# Altium project Lora-ver1.0.PrjPCB
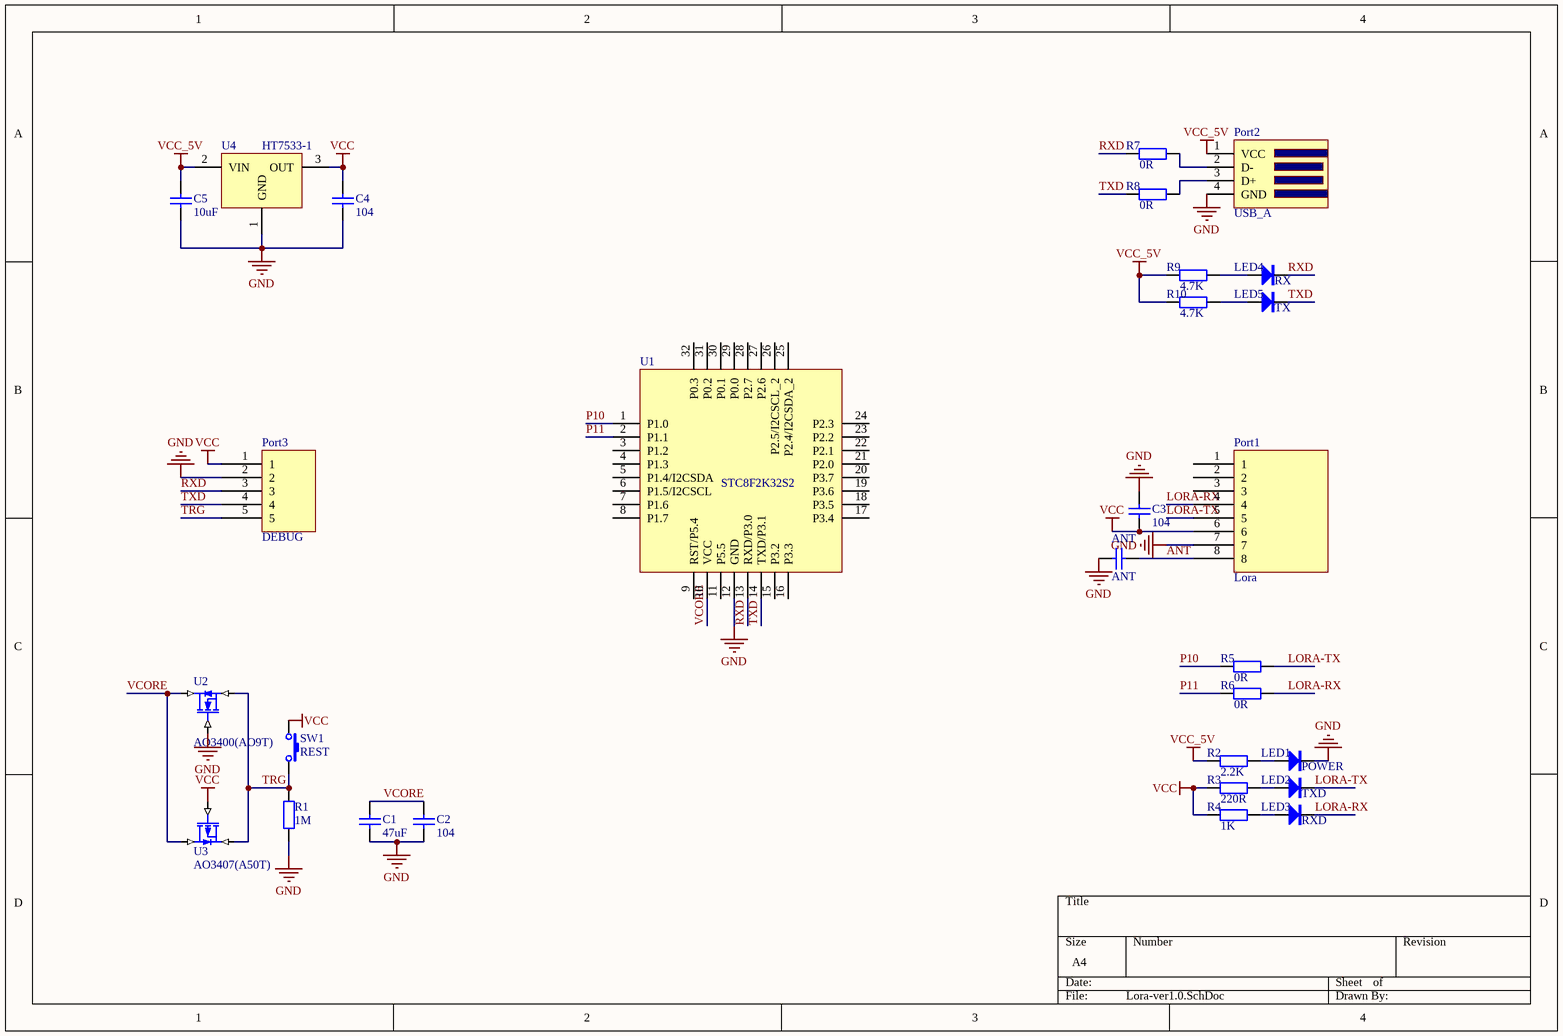
[diagram p0: Lora-ver1.0.SchDoc]
1 sheet, 29 parts. Net scope: global (net labels, ports and power ports of the same name join across sheets).
Board file: Lora_ver1.0.PcbDoc

## Sheet Lora-ver1.0.SchDoc
size A4

### Parts
ANT  ANT  [SWA-KE天线母座]
C1  47uF  [0603]
C2  104  [0603]
C3  104  [0603]
C4  104  [0603]
C5  10uF  [0603]
LED1  POWER  [2.54LED]
LED2  TXD  [2.54LED]
LED3  RXD  [2.54LED]
LED4  RX  [LED-0603]
LED5  TX  [LED-0603]
Port1  Lora  [LoRa_Usart]
Port2  USB_A  [USB-A]
Port3  DEBUG  [STC_DEBUG]
R1  1M  [0603]
R2  2.2K  [0603]
R3  220R  [0603]
R4  1K  [0603]
R5  0R  [0603]
R6  0R  [0603]
R7  0R  [0603]
R8  0R  [0603]
R9  4.7K  [0603]
R10  4.7K  [0603]
SW1  REST  [SW-1]
U1  STC8F2K32S2  [LQPF-32]
U2  AO3400(AO9T)  [SOT-23]
U3  AO3407(A50T)  [SOT-23]
U4  HT7533-1  [3A5A3D]

### Nets
GND: ANT.2 C1.1 C2.1 C3.1 C4.2 C5.2 LED1.2 Port1.7 Port2.4(GND) Port3.2 R1.1 U1.12(GND) U2.1(G) U4.1(GND)
VCC: C3.2 C4.1 Port1.6 Port3.1 R3.2 R4.2 SW1.1 U3.1(G) U4.3(OUT)
VCC_5V: C5.1 Port2.1(VCC) R2.2 R9.2 R10.2 U4.2(VIN)
ANT: ANT.1 Port1.8
LORA-RX: LED3.2 Port1.4 R6.1
LORA-TX: LED2.2 Port1.5 R5.1
P10: R5.2 U1.1(P1.0)
P11: R6.2 U1.2(P1.1)
RXD: LED4.2 Port3.3 R7.2 U1.13(RXD/P3.0)
TRG: Port3.5 R1.2 SW1.2 U2.2(D) U3.2(S)
TXD: LED5.2 Port3.4 R8.2 U1.14(TXD/P3.1)
VCORE: C1.2 C2.2 U1.10(VCC) U2.3(S) U3.3(D)
NetLED1_1: LED1.1 R2.1
NetLED2_1: LED2.1 R3.1
NetLED3_1: LED3.1 R4.1
NetLED4_1: LED4.1 R9.1
NetLED5_1: LED5.1 R10.1
NetPort2_2: Port2.2(D-) R7.1
NetPort2_3: Port2.3(D+) R8.1

Not connected (* = marked no-connect by the designer): Port1 1 2 3; U1 3(P1.2) 4(P1.3) 5(P1.4/I2CSDA) 6(P1.5/I2CSCL) 7(P1.6) 8(P1.7) 9(RST/P5.4) 11(P5.5) 15(P3.2) 16(P3.3) 17(P3.4) 18(P3.5) 19(P3.6) 20(P3.7) 21(P2.0) 22(P2.1) 23(P2.2) 24(P2.3) 25(P2.4/I2CSDA_2) 26(P2.5/I2CSCL_2) 27(P2.6) 28(P2.7) 29(P0.0) 30(P0.1) 31(P0.2) 32(P0.3)

### Library data of the parts
ANT C1-C5 = Cap: Capacitor; Published: 8-Jun-2000; LatestRevisionDate: 17-Jul-2002; LatestRevisionNote: Re-released for DXP Platform.; PackageReference: RAD-0.3; Publisher: Altium Limited
LED1-LED5 = DIODE
Port2 = USB
Port3 = PIN-5
R1-R10 = Res2: Resistor; Published: 8-Jun-2000; LatestRevisionDate: 17-Jul-2002; LatestRevisionNote: Re-released for DXP Platform.; PackageReference: AXIAL-0.4; Publisher: Altium Limited
SW1 = SW-P: key
U1 = STC8F2K64S2
U2 = MOSFET-N: mosfet
U3 = MOSFET-P: mosfet